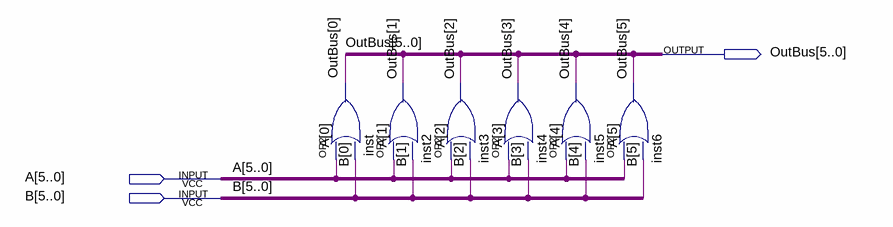
[diagram p0: schematic sheet]
// Quartus schematic BUSSUM2.bdf as structural Verilog: 6 symbols, 3 pins
module BUSSUM2 (
  input  [5:0] A,
  input  [5:0] B,
  output [5:0] OutBus
);

  or inst (OutBus[0], A[0], B[0]);
  or inst2 (OutBus[1], A[1], B[1]);
  or inst3 (OutBus[2], A[2], B[2]);
  or inst4 (OutBus[3], A[3], B[3]);
  or inst5 (OutBus[4], A[4], B[4]);
  or inst6 (OutBus[5], A[5], B[5]);
endmodule
